# EAGLE schematic waterDropCapture (EAGLE 7.2.0)
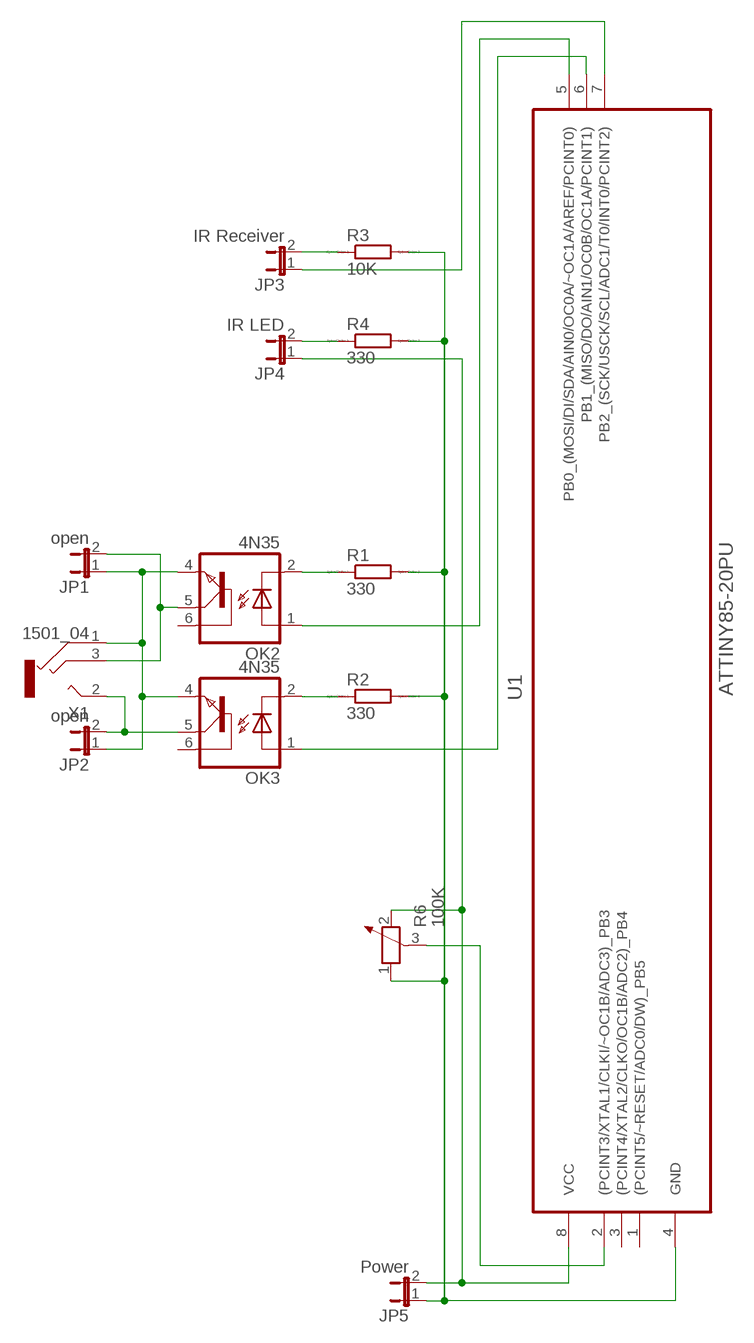
[diagram p0: schematic, sheet 1]

## Parts
JP1  open  JP1E  [JP1]
JP2  open  JP1E  [JP1]
JP3  IR Receiver  JP1E  [JP1]
JP4  IR LED  JP1E  [JP1]
JP5  Power  JP1E  [JP1]
OK2  4N35  [DIL06]
OK3  4N35  [DIL06]
R1  330  R0207/10  [0207/10]
R2  330  R0207/10  [0207/10]
R3  10K  R0207/10  [0207/10]
R4  330  R0207/10  [0207/10]
R6  100K  POTENTIOMETER_PT-10  [PT-10]
U1  ATTINY85-20PU  [DIP254P762X533-8]
X1  1501_04  [1501_05]

## Nets
N$1: OK2.2(C) R1.1
N$2: OK3.2(C) R2.1
N$4: JP1.1 JP2.1 OK2.4(EMI) OK3.4(EMI) X1.1
N$5: OK2.1(A) U1.5(PB0_(MOSI/DI/SDA/AIN0/OC0A/~OC1A/AREF/PCINT0))
N$6: JP2.2 OK3.5(COL) X1.2
N$7: JP5.1 R1.2 R2.2 R3.2 R4.2 R6.1 U1.4(GND)
N$8: OK3.1(A) U1.6(PB1_(MISO/DO/AIN1/OC0B/OC1A/PCINT1))
N$9: JP4.2 R4.1
N$10: JP1.2 OK2.5(COL) X1.3
N$11: JP4.1 JP5.2 R6.2 U1.8(VCC)
N$12: JP3.2 R3.1
N$13: JP3.1 U1.7(PB2_(SCK/USCK/SCL/ADC1/T0/INT0/PCINT2))
N$14: R6.3 U1.2((PCINT3/XTAL1/CLKI/~OC1B/ADC3)_PB3)
Unconnected: OK2.6(BAS) OK3.6(BAS) U1.1((PCINT5/~RESET/ADC0/DW)_PB5) U1.3((PCINT4/XTAL2/CLKO/OC1B/ADC2)_PB4)

## Library data of the parts
JP1-JP5 = jumper:JP1E: JUMPER
OK2 OK3 = optocoupler:4N35: MOTOROLA OPTO COUPLER; MF: FAIRCHILD SEMICONDUCTOR; MPN: 4N35; OC_FARNELL: 1328375; OC_NEWARK: 72K9946
R1-R4 = eagle-ltspice:R: RESISTOR, European symbol; SPICEMODEL: NONE; SPICEPREFIX: R
R6 = rcl:POTENTIOMETER_: Potentiometer
U1 = Atmel_By_element14_Batch_1-00:ATTINY85-20PU: 8-bit Microcontroller with In-System Programmable Flash; MPN: ATTINY85-20PU; OC_FARNELL: 1455162; OC_NEWARK: 58M3796; PACKAGE: PDIP-8; SUPPLIER: Atmel
X1 = con-lumberg:1501_0*: Jack connectors according to JISC 6560, 2.5 mm Klinkensteckverbinder nach JISC 6560, 2,5 mm Source: http://www.lumberg.com/Produkte/PDFs/1501_05.pdfedit 1501_03 http://www.lumberg.com/Produkte/PDFs/1501_06.pdf; OC_FARNELL: 1216977; OC_NEWARK: unknown